# Altium schematic sheet DT_AZP1524B1_SCH1[SHEET2]_00A.SchDoc
size A3; CheckedBy: XXX; Author: DO NOT USE THIS PARAMETER; CompanyName: Azoteq (Pty) Ltd; Engineer: DO NOT USE THIS PARAMETER; SheetNumber: 2; SheetTotal: 2; Sheet_Title: Sheet 2
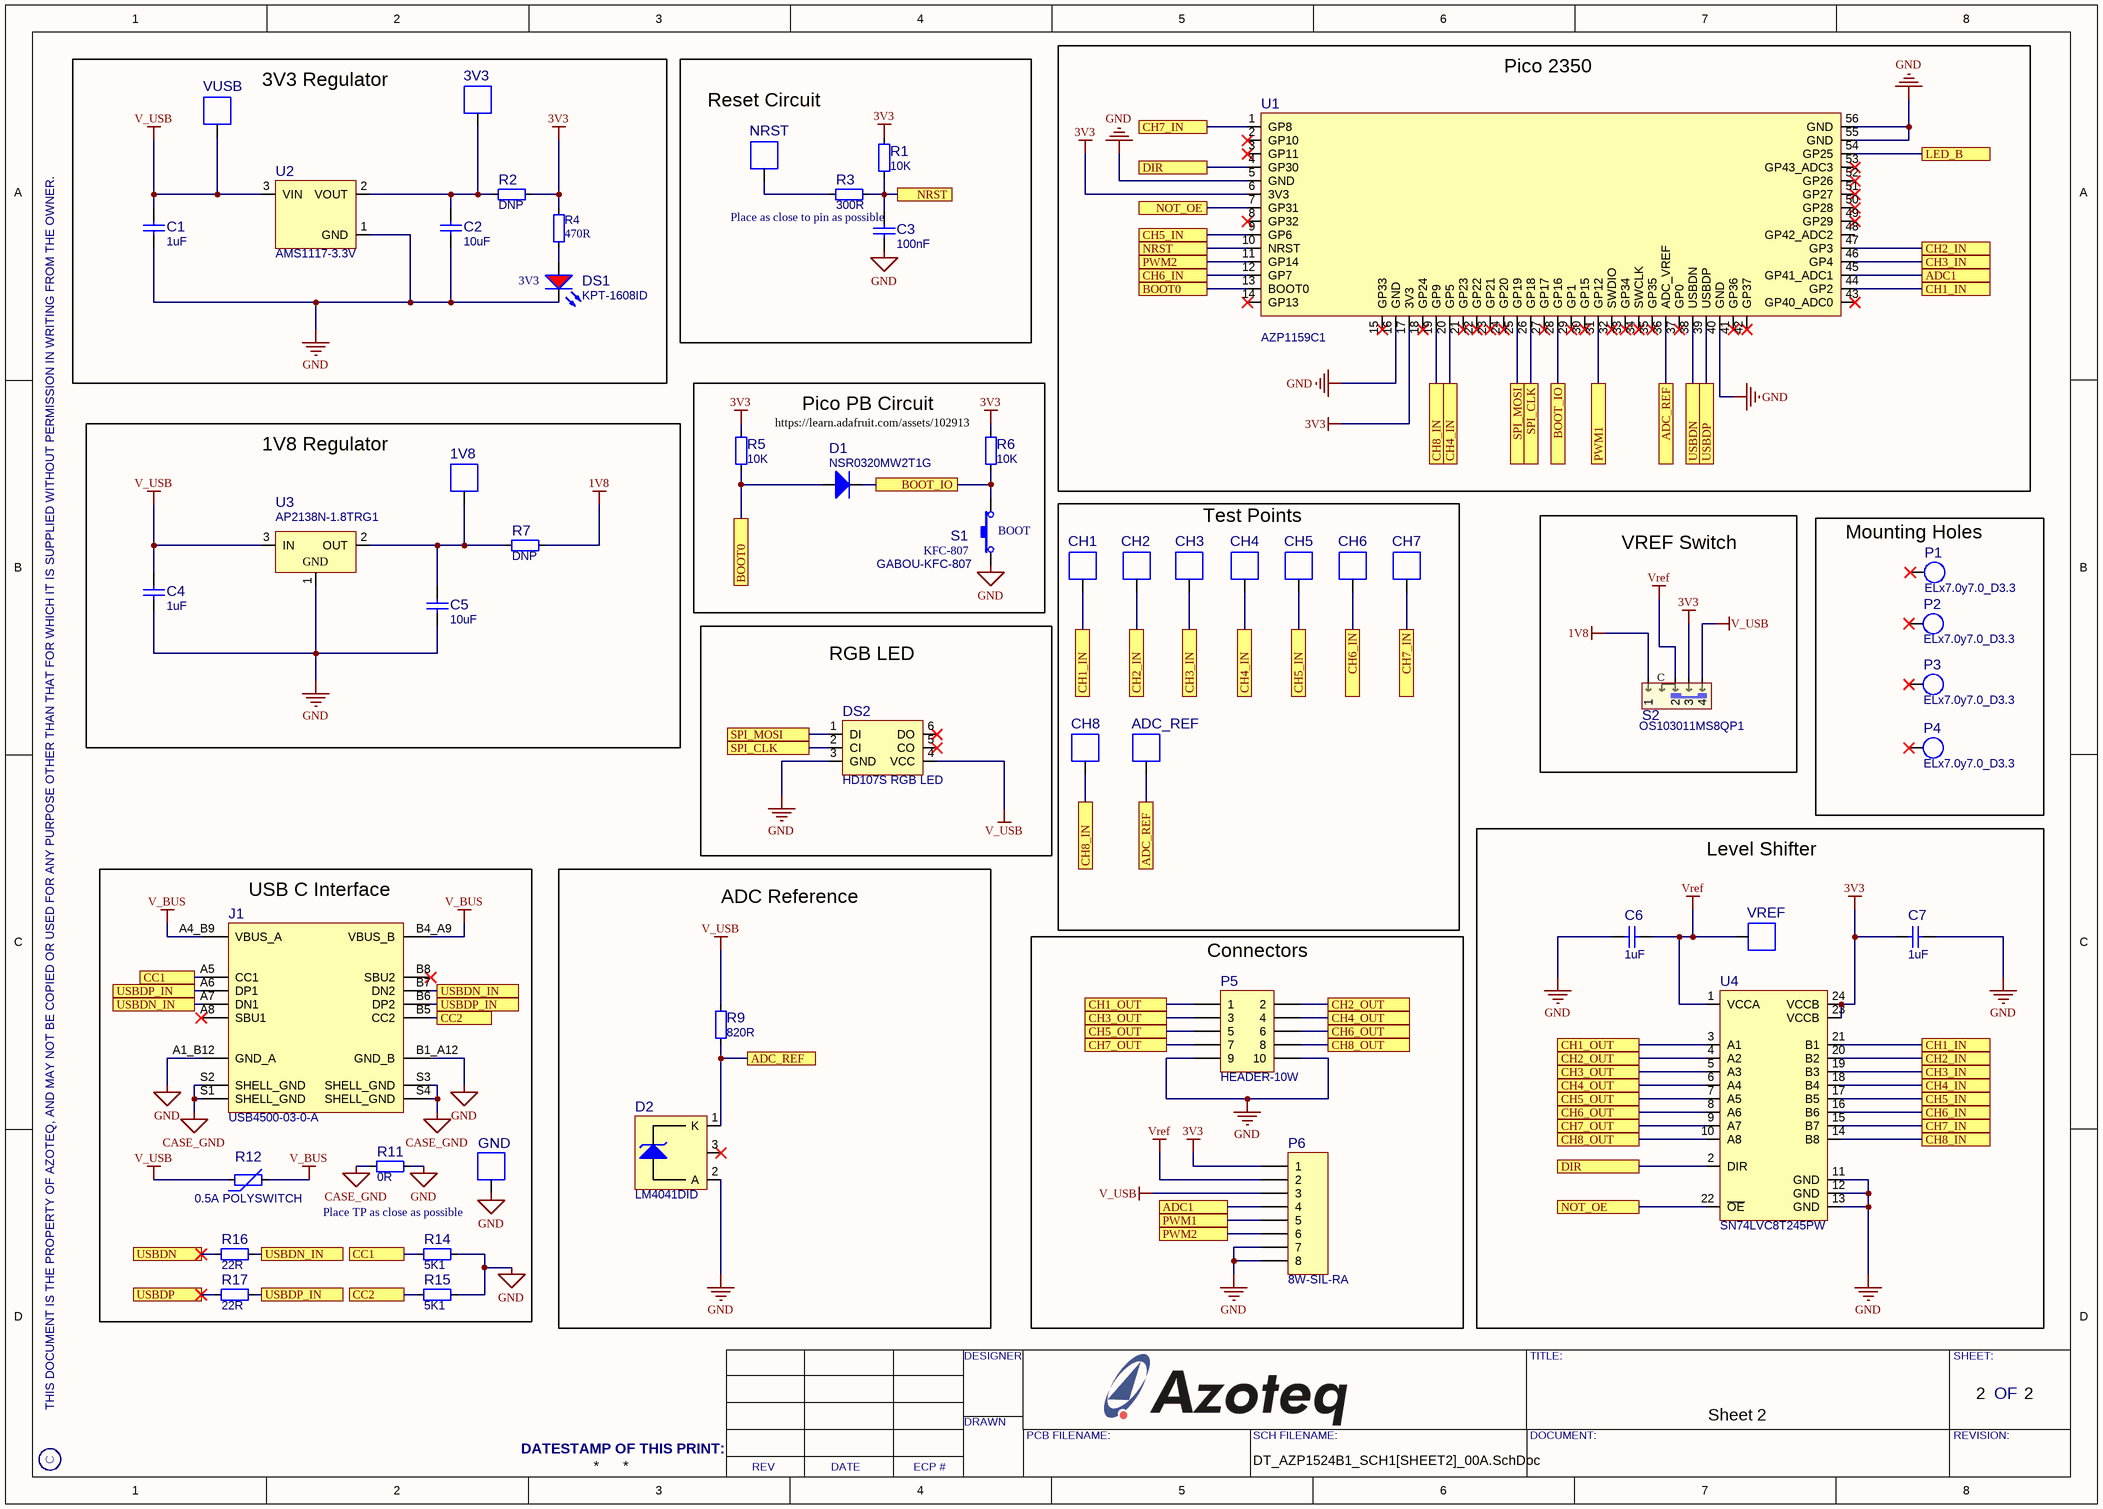
[diagram p0: DT_AZP1524B1_SCH1[SHEET2]_00A.SchDoc]

## Parts
1V8  (no value)  [TEST-POINT-1.5MM]  (no BOM)
3V3  (no value)  [TEST-POINT-1.5MM]  (no BOM)
ADC_REF  (no value)  [TEST-POINT-1.5MM]  (no BOM)
C1  1uF  [C-0603]
C2  10uF  [C-0603]
C3  100nF  [C-0603]
C4  1uF  [C-0603]
C5  10uF  [C-0603]
C6  1uF  [C-0603]
C7  1uF  [C-0603]
CH1  (no value)  [TEST-POINT-1.5MM]  (no BOM)
CH2  (no value)  [TEST-POINT-1.5MM]  (no BOM)
CH3  (no value)  [TEST-POINT-1.5MM]  (no BOM)
CH4  (no value)  [TEST-POINT-1.5MM]  (no BOM)
CH5  (no value)  [TEST-POINT-1.5MM]  (no BOM)
CH6  (no value)  [TEST-POINT-1.5MM]  (no BOM)
CH7  (no value)  [TEST-POINT-1.5MM]  (no BOM)
CH8  (no value)  [TEST-POINT-1.5MM]  (no BOM)
D1  NSR0320MW2T1G  [D-SOD-323]
D2  LM4041DID  [SOT-23]
DS1  KPT-1608ID  [D-LED-RED-0603]
DS2  HD107S RGB LED  [CABA-CBT-5050GHRGB-16T]
GND  (no value)  [TEST-POINT-1.5MM]  (no BOM)
J1  USB4500-03-0-A  [J-USB-GCT-USB4500-03-0-A]
NRST  (no value)  [TEST-POINT-1.5MM]  (no BOM)
P1  ELx7.0y7.0_D3.3  [MPAD-X7.0Y7.0_D3.3]  (no BOM)
P2  ELx7.0y7.0_D3.3  [MPAD-X7.0Y7.0_D3.3]  (no BOM)
P3  ELx7.0y7.0_D3.3  [MPAD-X7.0Y7.0_D3.3]  (no BOM)
P4  ELx7.0y7.0_D3.3  [MPAD-X7.0Y7.0_D3.3]  (no BOM)
P5  HEADER-10W  [P-BERG-10W-HDR-EDGE]
P6  8W-SIL-RA  [P-BERG-8W-HDR-RA-SIL]
R1  10K  [R-0603]
R2  DNP  [R-0603]
R3  300R  [R-0603]
R4  470R  [R-0603]
R5  10K  [R-0603]
R6  10K  [R-0603]
R7  DNP  [R-0603]
R9  820R  [R-0603]
R11  0R  [R-0603]
R12  0.5A POLYSWITCH  [R-POLYSWITCH-1206]
R14  5K1  [R-0603]
R15  5K1  [R-0603]
R16  22R  [R-0603]
R17  22R  [R-0603]
S1  GABOU-KFC-807  value KFC-807  [S-GABOU-KFC-807]
S2  OS103011MS8QP1  [S-C&K-OS103011MS8QP1]
U1  AZP1159C1  [AZP1159C1]
U2  AMS1117-3.3V  [SOT-223]
U3  AP2138N-1.8TRG1  [SOT-23]
U4  SN74LVC8T245PW  [U-TSSOP-24]
VREF  (no value)  [TEST-POINT-1.5MM]  (no BOM)
VUSB  (no value)  [TEST-POINT-1.5MM]  (no BOM)

## Blocks framed on the sheet
3V3 Regulator: 3V3 C1 C2 DS1 R2 R4 U2 VUSB
Reset Circuit: C3 NRST R1 R3
Pico 2350: U1
Pico PB Circuit: D1 R5 R6 S1
1V8 Regulator: 1V8 C4 C5 R7 U3
Test Points: ADC_REF CH1-CH8
VREF Switch: S2
Mounting Holes: P1-P4
RGB LED: DS2
USB C Interface: GND J1 R11 R12 R14-R17
ADC Reference: D2 R9
Level Shifter: C6 C7 U4 VREF
Connectors: P5 P6

## Ports
ADC1, ADC_REF, BOOT0, BOOT_IO, CC1, CC2, CH1_IN, CH1_OUT, CH2_IN, CH2_OUT, CH3_IN, CH3_OUT, CH4_IN, CH4_OUT, CH5_IN, CH5_OUT, CH6_IN, CH6_OUT, CH7_IN, CH7_OUT, CH8_IN, CH8_OUT, DIR, LED_B, NOT_OE, NRST, PWM1, PWM2, SPI_CLK, SPI_MOSI, USBDN, USBDN_IN, USBDP, USBDP_IN

## Nets
1V8: R7.2 S2.1
3V3: C7.2 P6.1 R1.2 R2.2 R4.2 R5.1 R6.1 S2.3 U1.6(3V3) U1.17(3V3) U4.23(VCCB) U4.24(VCCB)
CASE_GND: J1.S1(SHELL_GND) J1.S2(SHELL_GND) J1.S3(SHELL_GND) J1.S4(SHELL_GND) R11.1
GND: C1.1 C2.1 C3.1 C4.1 C5.1 C6.2 C7.1 D2.2(A) DS1.1(K) DS2.3(GND) GND.1 J1.A1_B12(GND_A) J1.B1_A12(GND_B) P5.9 P5.10 P6.7 P6.8 R11.2 R14.2 R15.2 S1.1 U1.5(GND) U1.16(GND) U1.40(GND) U1.55(GND) U1.56(GND) U2.1(GND) U3.1(GND) U4.11(GND) U4.12(GND) U4.13(GND)
V_BUS: J1.A4_B9(VBUS_A) J1.B4_A9(VBUS_B) R12.2
V_USB: C1.2 C4.2 DS2.4(VCC) P6.3 R9.2 R12.1 S2.4 U2.3(VIN) U3.3(IN) VUSB.1
Vref: C6.1 P6.2 S2.2 U4.1(VCCA) VREF.1
ADC1: P6.4 U1.45(GP41_ADC1) ; port ADC1
ADC_REF: ADC_REF.1 D2.1(K) R9.1 U1.36(ADC_VREF) ; port ADC_REF
BOOT0: D1.2(K) R5.2 U1.13(BOOT0) ; port BOOT0
BOOT_IO: D1.1(K) R6.2 S1.2 U1.28(GP16) ; port BOOT_IO
CC1: J1.A5(CC1) R14.1 ; port CC1
CC2: J1.B5(CC2) R15.1 ; port CC2
CH1_IN: CH1.1 U1.44(GP2) U4.21(B1) ; port CH1_IN
CH1_OUT: P5.1 U4.3(A1) ; port CH1_OUT
CH2_IN: CH2.1 U1.47(GP3) U4.20(B2) ; port CH2_IN
CH2_OUT: P5.2 U4.4(A2) ; port CH2_OUT
CH3_IN: CH3.1 U1.46(GP4) U4.19(B3) ; port CH3_IN
CH3_OUT: P5.3 U4.5(A3) ; port CH3_OUT
CH4_IN: CH4.1 U1.20(GP5) U4.18(B4) ; port CH4_IN
CH4_OUT: P5.4 U4.6(A4) ; port CH4_OUT
CH5_IN: CH5.1 U1.9(GP6) U4.17(B5) ; port CH5_IN
CH5_OUT: P5.5 U4.7(A5) ; port CH5_OUT
CH6_IN: CH6.1 U1.12(GP7) U4.16(B6) ; port CH6_IN
CH6_OUT: P5.6 U4.8(A6) ; port CH6_OUT
CH7_IN: CH7.1 U1.1(GP8) U4.15(B7) ; port CH7_IN
CH7_OUT: P5.7 U4.9(A7) ; port CH7_OUT
CH8_IN: CH8.1 U1.19(GP9) U4.14(B8) ; port CH8_IN
CH8_OUT: P5.8 U4.10(A8) ; port CH8_OUT
DIR: U1.4(GP30) U4.2(DIR) ; port DIR
LED_B: U1.54(GP25) ; port LED_B
NOT_OE: U1.7(GP31) U4.22(~{OE}) ; port NOT_OE
NRST: C3.2 R1.1 R3.2 U1.10(NRST) ; port NRST
PWM1: P6.5 U1.31(GP12) ; port PWM1
PWM2: P6.6 U1.11(GP14) ; port PWM2
SPI_CLK: DS2.2(CI) U1.26(GP18) ; port SPI_CLK
SPI_MOSI: DS2.1(DI) U1.25(GP19) ; port SPI_MOSI
USBDN: R16.1 U1.38(USBDN) ; port USBDN
USBDN_IN: J1.A7(DN1) J1.B7(DN2) R16.2 ; port USBDN_IN
USBDP: R17.2 U1.39(USBDP) ; port USBDP
USBDP_IN: J1.A6(DP1) J1.B6(DP2) R17.1 ; port USBDP_IN
Net1V8_1: 1V8.1 C5.2 R7.1 U3.2(OUT)
Net3V3_1: 3V3.1 C2.2 R2.1 U2.2(VOUT)
NetDS1_2: DS1.2(A) R4.1
NetNRST_1: NRST.1 R3.1

Not connected (* = marked no-connect by the designer): D2 3*; DS2 5(CO)* 6(DO)*; J1 A8(SBU1)* B8(SBU2)*; P1 1*; P2 1*; P3 1*; P4 1*; U1 2(GP10)* 3(GP11)* 8(GP32)* 14(GP13)* 15(GP33)* 18(GP24)* 21(GP23)* 22(GP22)* 23(GP21)* 24(GP20)* 27(GP17)* 29(GP1)* 30(GP15)* 32(SWDIO)* 33(GP34)* 34(SWCLK)* 35(GP35)* 37(GP0)* 41(GP36)* 42(GP37)* 43(GP40_ADC0)* 48(GP42_ADC2) 49(GP29)* 50(GP28)* 51(GP27)* 52(GP26)* 53(GP43_ADC3)*

## Notes on the sheet
- (near C3) Place as close to pin as possible
- (near DS1) 3V3
- (near R6) https://learn.adafruit.com/assets/102913
- (near S1) BOOT
- Place TP as close as possible
- DESIGNER
- TITLE:
- SHEET:
- OF
- THIS DOCUMENT IS THE PROPERTY OF AZOTEQ, AND MAY NOT BE COPIED OR USED FOR ANY PURPOSE OTHER THAN THAT FOR WHICH IT IS SUPPLIED WITHOUT PERMISSION IN WRITING FROM THE OWNER.
- C
- DATESTAMP OF THIS PRINT:
- REV
- DATE
- ECP #
- DRAWN
- PCB FILENAME:
- SCH FILENAME:
- DOCUMENT:
- REVISION:
- (in symbol C&K-OS103011MS8QP1) C

## Library data of the parts
1V8 3V3 ADC_REF CH1-CH8 GND NRST VREF VUSB = TEST-POINT-SMD-1.5MM: Generated_By: GHM; Int_Part_Number: *; Checked_By: *; Checked_Date: *; HelpURL: *; ComponentLink1Description: Footprint Detail; ComponentLink1URL: *; ComponentLink2Description: Application Note; ComponentLink2URL: *; ComponentLink3Description: Layout Guidelines; ComponentLink3URL: *; Wattage: *; Int_Note: *
C1 C4 C6 C7 = CAP 1u0F 0603 CER X5R 10% 10V: Capacitor, Ceramic, 1uF, 0603, X5R, 10%, 10V; Int_Part_Number: CAP0021; Manufacturer: Samsung; Manufacturer_PN: CL10A105KP8NNNC; Checked_By: Jason Reinecke; 3D Model: YES; Int_Note: Created for Marike Swart; Generated_By: JR; Pin_Count: 2; Type: SMT; Dept.: LightSense; Generated_Date: 2023-04-06; HelpURL: \\azoteq-files1\PCBCAD\Datasheets\Capacitors\Samsung\CL10A105KP8NNNC_Spec.pdf; ComponentLink1Description: Footprint Detail; ComponentLink1URL: *; ComponentLink2Description: Application Note; ComponentLink2URL: *; ComponentLink3Description: Layout Guidelines; ComponentLink3URL: *; Tolerance: 10%; Wattage: *; Voltage: 10V; Value: 1uF; Local_Supplier: Mouser; Local_Supplier_PN: 187-CL10A105KP8NNNC; Offshore_Supplier: Digikey; Offshore_Supplier_PN: 1276-1182-2-ND; Supplier: Azoteq
C2 C5 = CAP 10uF 0603 CER X5R 20% 6V3 SAMSUNG: Capacitor, Ceramic, 10uF, 0603, X5R, 20%, 6V3 SAMSUNG; Int_Part_Number: CAP0076; Manufacturer_PN: CL10A106MQ8NNNC; Checked_By: Jason Reinecke; 3D Model: YES; Int_Note: Created for Marike Swart; Generated_By: JR; Pin_Count: 2; Type: SMT; Dept.: LightSense; Manufacturer: SAMSUNG; Generated_Date: 2023-04-05; HelpURL: \\Azoteq-files1\pcbcad\Datasheets\Capacitors\TDK Ceramic Mid Voltage.pdf; ComponentLink1Description: Footprint Detail; ComponentLink1URL: *; ComponentLink2Description: Application Note; ComponentLink2URL: *; ComponentLink3Description: Layout Guidelines; ComponentLink3URL: *; Tolerance: 20%; Wattage: *; Voltage: 6V3; Value: 10uF; Local_Supplier: Mouser; Local_Supplier_PN: 187-CL10A106MQ8NNNC; Offshore_Supplier: Digikey; Offshore_Supplier_PN: 1276-1119-2-ND; Supplier: Azoteq
C3 = CAP 100nF 0603 CER X7R 10% 50V: Capacitor, Ceramic, 100nF, 0603, X7R, 10%, 50V; Int_Part_Number: CAP0032; Manufacturer: Samsung; Manufacturer_PN: CL10B104KB8NNNC; Checked_By: Jason Reinecke; Int_Note: Created for Marike Swart; Generated_By: JR; Pin_Count: 2; Type: SMT; 3D Model: YES; Dept.: LightSense; Generated_Date: 2023-04-20; HelpURL: \\Azoteq-files1\pcbcad\Datasheets\Capacitors\Samsung Ceramic.pdf; ComponentLink1Description: Footprint Detail; ComponentLink1URL: *; ComponentLink2Description: Application Note; ComponentLink2URL: *; ComponentLink3Description: Layout Guidelines; ComponentLink3URL: *; Tolerance: 10%; Wattage: *; Voltage: 50V; Value: 100nF; Local_Supplier: Mouser; Local_Supplier_PN: 187-CL10B104KB8NNNC; Offshore_Supplier: Digikey; Offshore_Supplier_PN: 1276-1000-2-ND; Supplier: Azoteq
D1 = Diode Schottky 20V 1A SOD-323: Diode Schottky 20V 1A 2-Pin SOD-323 T/R; Int_Part_Number: DIO0074; Manufacturer: ONsemiconductors; Generated_By: JR; Pin_Count: 2; Type: SMT; Manufacturer_PN: NSR0320MW2T1G; Checked_By: *; Checked_Date: *; Generated_Date: 2017-09-11; ComponentLink1Description: Footprint Detail; ComponentLink1URL: *; ComponentLink2Description: Application Note; ComponentLink2URL: *; ComponentLink3Description: Layout Guidelines; ComponentLink3URL: *; Wattage: 1A; Voltage: 20V; Int_Note: *; Value: NSR0320MW2T1G; Supplier: Azoteq; MSL: 1
D2 = DIODE-ZENER-LM4041-SOT-23: Manufacturer: Texas Instruments; Manufacturer_PN: LM4041DIDBZTG4; Generated_By: GHM; Pin_Count: 3; Type: SMT; Checked_By: *; Checked_Date: *; Generated_Date: 2012-03-13; HelpURL: \\Azoteq-files1\pcbcad\Datasheets\Voltage References\Texas Instruments\LM4041DIDBZTG4.pdf; ComponentLink1Description: Footprint Detail; ComponentLink1URL: *; ComponentLink2Description: Application Note; ComponentLink2URL: *; ComponentLink3Description: Layout Guidelines; ComponentLink3URL: *; Wattage: *; Int_Note: *; Value: LM4041DID; Local_Supplier: RS Components; Local_Supplier_PN: 661-9405; Supplier: Azoteq
DS1 = LED-KPT1608ID-RED-0603: Manufacturer: KingBright; Generated_By: GHM; Pin_Count: 2; Type: SMT; Int_Part_Number: *; Manufacturer_PN: KPT-1608ID; Checked_By: *; Checked_Date: *; HelpURL: \\Azoteq-files1\pcbcad\Datasheets\LEDs\KingBright\KPT-1608.pdf; ComponentLink1Description: Footprint Detail; ComponentLink1URL: *; ComponentLink2Description: Application Note; ComponentLink2URL: *; ComponentLink3Description: Layout Guidelines; ComponentLink3URL: *; Wattage: *; Int_Note: *; Value: KPT-1608ID; Local_Supplier: Communica; Local_Supplier_PN: KPT-1608ID; Supplier: Azoteq
DS2 = LED-NEWSTAR-HD107S RGB LED: LED, 5.5x5.0x1.6mm TOP SMD Type 0.2Watt; Manufacturer: NEW STAR LED CO., LIMITED; 3D_Part: No; Voltage: 5V; Int_Note: Created for Nico Lochner; Generated_By: JR; Pin_Count: 6; Type: SMT; Manufacturer_PN: HD107S; Checked_By: *; Checked_Date: *; Generated_Date: 2020-10-23; HelpURL: \\azoteq-files1\PCBCAD\Datasheets\LEDs\NewStar\HD107S-NEWSTAR.pdf; ComponentLink1Description: Footprint Detail; ComponentLink1URL: *; ComponentLink2Description: Application Note; ComponentLink2URL: *; ComponentLink3Description: Layout Guidelines; ComponentLink3URL: *; Wattage: *; Value: HD107S RGB LED; Supplier: Azoteq
J1 = USB-GCT-USB4500-03-0-A: USB-C TYPE REC 16P, 3U" MID MNT 0.8MM USB2.0; Int_Part_Number: NONE; Manufacturer: GCT; Checked_By: Jason Reinecke; Tolerance: na; Wattage: 5A; Voltage: 20V; Int_Note: Created for Ferdinand Stegmann; Generated_By: JR; Pin_Count: 16; Dept.: ProxSense; 3D Model: YES; Manufacturer_PN: USB4500-03-0-A; Generated_Date: 2022-02-24; HelpURL: \\azoteq-files1\PCBCAD\Datasheets\USB\GCT\usb4500.pdf; ComponentLink1Description: Footprint Detail; ComponentLink1URL: *; ComponentLink2Description: Application Note; ComponentLink2URL: *; ComponentLink3Description: Layout Guidelines; ComponentLink3URL: *; Value: USB4500-03-0-A; Local_Supplier: Mouser; Local_Supplier_PN: 640-USB4500030A; Offshore_Supplier: Digikey; Offshore_Supplier_PN: 2073-USB4500-03-0-ATR-ND; Type: SMT; Supplier: Azoteq
P1-P4 = MPAD-ELx7.0y7.0_D3.3: Generated_By: GHM; Int_Part_Number: *; Checked_By: *; Checked_Date: *; Generated_Date: 2013-08-27; HelpURL: *; ComponentLink1Description: Footprint Detail; ComponentLink1URL: *; ComponentLink2Description: Application Note; ComponentLink2URL: *; ComponentLink3Description: Layout Guidelines; ComponentLink3URL: *; Wattage: *; Int_Note: *; Value: ELx7.0y7.0_D3.3
P5 = BERG-10W-HDR-EDGE: Connector, Header, Edge Mount,DIL, 10W, SMT; Generated_By: GHM; Pin_Count: 10; Int_Part_Number: *; Checked_By: *; Checked_Date: *; Generated_Date: 2013-07-29; ComponentLink1Description: Footprint Detail; ComponentLink1URL: *; ComponentLink2Description: Application Note; ComponentLink2URL: *; ComponentLink3Description: Layout Guidelines; ComponentLink3URL: *; Wattage: *; Int_Note: *; Value: HEADER-10W; Local_Supplier: Communica; Type: SMT; Supplier: Azoteq
P6 = BERG-8W-HDR-RA-SIL: Connector, Header, Right angle, SIL, 8W, THP; Manufacturer: Ho Chien; Generated_By: GHM; Pin_Count: 8; ComponentLink1Description: Footprint Detail; ComponentLink2Description: Application Note; ComponentLink3Description: Layout Guidelines; HelpURL: \\azoteq-files1\pcbcad\Datasheets\Headers\Ho Chien Pin Header 2.54mm.pdf; Local_Supplier: Communica; Local_Supplier_PN: 709401; Value: 8W-SIL-RA; Type: THP; Supplier: Azoteq
R1 R3 R5 R6 = MNFR 0603 5% 0.1W: Resistor, 0603, 5%, 0.1W; Int_Part_Number: MNFR04; Checked_By: Jason Reinecke; Generated_By: JR; Pin_Count: 2; 3D Model: YES; Generated_Date: 2017-02-01; HelpURL: *; ComponentLink1Description: Footprint Detail; ComponentLink1URL: *; ComponentLink2Description: Application Note; ComponentLink2URL: *; ComponentLink3Description: Layout Guidelines; ComponentLink3URL: *; Tolerance: 5%; Wattage: 0.1W; Int_Note: *; Local_Supplier: Mouser; Offshore_Supplier: Digikey; Type: SMT; Supplier: Assembly Manufacturer
R2 R7 = RES DNP 0603: Resistor, DNP, 0603; Checked_By: Jason Reinecke; Generated_By: JR; Pin_Count: 2; 3D Model: YES; Int_Part_Number: DNP; Generated_Date: 2010-01-05; HelpURL: *; ComponentLink1Description: Footprint Detail; ComponentLink1URL: *; ComponentLink2Description: Application Note; ComponentLink2URL: *; ComponentLink3Description: Layout Guidelines; ComponentLink3URL: *; Int_Note: *; Local_Supplier: Mouser; Offshore_Supplier: Digikey; Value: DNP; Type: SMT; Supplier: Azoteq
R4 = RES 470R 0603 5% 0.1W Yageo: Res Thick Film 0603 470 Ohm 5% 0.1W(1/10W) ±100ppm/°C Molded SMD Paper T/R; Int_Part_Number: RES0307; Manufacturer: Yageo; Manufacturer_PN: RC0603JR-07470RL; Checked_By: Jason Reinecke; Generated_By: JR; Pin_Count: 2; 3D Model: YES; ComponentLink1Description: Footprint Detail; ComponentLink1URL: *; ComponentLink2Description: Application Note; ComponentLink2URL: *; ComponentLink3Description: Layout Guidelines; ComponentLink3URL: *; Generated_Date: 2017-07-01; HelpURL: *; Int_Note: *; Local_Supplier: Mouser; Offshore_Supplier: Digikey; Tolerance: 5%; Value: 470R; Wattage: 0.1W; Type: SMT; SheetPart: *; Supplier: Azoteq
R9 = RES 820R 0603 1% 0.1W: Resistor, 820R, 0603, 1%, 0.1W; Checked_By: Jason Reinecke; Generated_By: JR; Pin_Count: 2; 3D Model: YES; Int_Part_Number: *; Generated_Date: 2009-10-13; HelpURL: *; ComponentLink1Description: Footprint Detail; ComponentLink1URL: *; ComponentLink2Description: Application Note; ComponentLink2URL: *; ComponentLink3Description: Layout Guidelines; ComponentLink3URL: *; Tolerance: 1%; Wattage: 0.1W; Int_Note: *; Value: 820R; Local_Supplier: Mouser; Local_Supplier_PN: CHR0603 1% 820R; Offshore_Supplier: Digikey; Type: SMT; Supplier: Azoteq
R11 = RES 0R 0603 1% 0.1W Yageo: Res Thick Film 0603 0 Ohm Molded SMD Paper T/R; Int_Part_Number: RES0139; Manufacturer: Yageo; Manufacturer_PN: RC0603JR--070R; Checked_By: Jason Reinecke; Tolerance: 1%; Wattage: 0.1W; Generated_By: JR; Pin_Count: 2; 3D Model: YES; Generated_Date: 2009-10-13; HelpURL: *; ComponentLink1Description: Footprint Detail; ComponentLink1URL: *; ComponentLink2Description: Application Note; ComponentLink2URL: *; ComponentLink3Description: Layout Guidelines; ComponentLink3URL: *; Int_Note: *; Value: 0R; Local_Supplier: Mouser; Offshore_Supplier: Digikey; Type: SMT; Supplier: Azoteq
R12 = POLYSWITCH-nanoSMDC050F/13.2: Polyswitch, nanoSMDC050F, 1206, 0.5A, 13.2V; Int_Part_Number: SWT0070; Manufacturer: Tyco; Checked_By: Jason Reinecke; Generated_By: JR; Pin_Count: 2; Manufacturer_PN: nanoSMDC050F/13.2; Generated_Date: 2011-02-25; HelpURL: \\Azoteq-files1\pcbcad\Datasheets\PTC\Tyco Electronics\Raychem PolySwitch 2011.pdf; ComponentLink1Description: Footprint Detail; ComponentLink1URL: *; ComponentLink2Description: Application Note; ComponentLink2URL: *; ComponentLink3Description: Layout Guidelines; ComponentLink3URL: *; Wattage: *; Int_Note: *; Value: 0.5A POLYSWITCH; Local_Supplier: Mouser; Local_Supplier_PN: 138-679; Offshore_Supplier: Digikey; Type: SMT; Supplier: Azoteq
R14-R17 = MNFR 0603 1% 0.1W: Resistor, 0603, 1%, 0.1W; Int_Part_Number: MNFR03; Generated_By: JR; Pin_Count: 2; Checked_By: *; Checked_Date: *; Generated_Date: 2017-02-01; HelpURL: *; ComponentLink1Description: Footprint Detail; ComponentLink1URL: *; ComponentLink2Description: Application Note; ComponentLink2URL: *; ComponentLink3Description: Layout Guidelines; ComponentLink3URL: *; Tolerance: 1%; Wattage: 0.1W; Int_Note: *; Type: SMT; Supplier: Assembly Manufacturer
  R14 R15: Value: 5K1
  R16 R17: Value: 22R
S1 = GABOU-KFC-807: SWITCH TACTILE SPST-NO 0.05A 12V; Manufacturer: GABOU; Int_Note: Created for Dylan Els; Generated_By: JR; Pin_Count: 2; Manufacturer_PN: KFC-807; Generated_Date: 201-06-18; HelpURL: http://www.gaboukeji.com/plus/view.php?aid=2679&vv=cn; ComponentLink1Description: Footprint Detail; ComponentLink2Description: Application Note; ComponentLink3Description: Layout Guidelines; Voltage: 12V; Type: SMT; Supplier: Azoteq
S2 = C&K-OS103011MS8QP1: SWITCH SLIDE SP3T 100MA 12V; Manufacturer: C&K; 3D_Part: No; Generated_By: JR; Pin_Count: 4; ComponentLink1Description: Footprint Detail; ComponentLink2Description: Application Note; ComponentLink3Description: Layout Guidelines; Generated_Date: 2018-04-24; HelpURL: \\Azoteq-files1\pcbcad\Datasheets\Switches\C&K\OS103011MS8QP1.pdf; Local_Supplier: Digikey; Local_Supplier_PN: CKN9543-ND; Manufacturer_PN: OS103011MS8QP1; Value: OS103011MS8QP1; Type: SMT; Supplier: Azoteq
U1 = AZP1159C1: AZP115C01: RP2350 Stamp (Pi Pico) - stamp breakout; Int_Part_Number: NONE; Manufacturer: Azoteq; Checked_By: Jason Reinecke; 3D Model: YES; Tolerance: na; Int_Note: Created for; Generated_By: JR; Pin_Count: 56; Dept.: ProxSense; Manufacturer_PN: AZP1159C1; Generated_Date: 2025-08-07; HelpURL: *; ComponentLink1Description: Footprint Detail; ComponentLink1URL: *; ComponentLink2Description: Application Note; ComponentLink2URL: *; ComponentLink3Description: Layout Guidelines; ComponentLink3URL: *; Wattage: *; Voltage: *; Value: AZP1159C1; Local_Supplier: Azoteq; Local_Supplier_PN: AZP1159C1; Offshore_Supplier: Azoteq; Offshore_Supplier_PN: AZP1159C1; Type: SMT; Supplier: Azoteq
U2 = AMS1117-MSKSEMI-SOT-223: IC, Voltage Regulator, 3.3V Out, 4.7-18V In, 1A; Int_Part_Number: NONE; Checked_By: Jason Reinecke; 3D Model: YES; Int_Note: Created for Kyle Steyn; Generated_By: JR; Pin_Count: 4; Manufacturer: MSKSEMI; Manufacturer_PN: AMS1117-3.3V; Generated_Date: 2024-06-03; HelpURL: \\azoteq-files1\PCBCAD\Datasheets\Voltage Regulators\MSKSEMI\MSKSEMI-AMS1117-3-3V.pdf; ComponentLink1Description: Footprint Detail; ComponentLink1URL: *; ComponentLink2Description: Application Note; ComponentLink2URL: *; ComponentLink3Description: Layout Guidelines; ComponentLink3URL: *; Tolerance: *; Wattage: *; Voltage: 3.3V; Value: AMS1117-3.3V; Local_Supplier: Mouser; Local_Supplier_PN: 863-LM1117MPX-33NOPB; Offshore_Supplier: Digikey; Offshore_Supplier_PN: 4518-AMS1117-3.3TR-ND; Type: SMT; Supplier: Azoteq
U3 = AP2138N-1.8TRG1-SOT-23: IC REG LINEAR 1.8V 250MA SOT23-3; Manufacturer: Diodes Incorporated; Checked_By: Jason Reinecke; 3D Model: YES; Int_Note: Created for Robert Samuel; Generated_By: JR; Pin_Count: 3; Int_Part_Number: *; Manufacturer_PN: AP2138N-1.8TRG1; Generated_Date: 2026-01-16; HelpURL: \\azoteq-files1\PCBCAD\Datasheets\Voltage Regulators\Diodes Inc\AP2138-9.pdf; ComponentLink1Description: Footprint Detail; ComponentLink1URL: *; ComponentLink2Description: Application Note; ComponentLink2URL: *; ComponentLink3Description: Layout Guidelines; ComponentLink3URL: *; Tolerance: *; Wattage: *; Voltage: 1.8V; Value: AP2138N-1.8TRG1; Local_Supplier: Mouser; Local_Supplier_PN: 621-AP2138N-1.8TRG1; Offshore_Supplier: Digikey; Offshore_Supplier_PN: AP2138N-1.8TRG1DITR-ND; Type: SMT; Supplier: Azoteq
U4 = SN74LVC8T245PW-TSSOP-24: Manufacturer: Texas Instruments; Manufacturer_PN: SN74LVC8T245PWG4; Generated_By: GHM; Pin_Count: 24; Int_Part_Number: *; Checked_By: *; Checked_Date: *; Generated_Date: 2012-03-13; HelpURL: \\Azoteq-files1\pcbcad\Datasheets\Tranceivers\Texas Instruments\SN74LVC8T245PWG4.pdf; ComponentLink1Description: Footprint Detail; ComponentLink1URL: *; ComponentLink2Description: Application Note; ComponentLink2URL: *; ComponentLink3Description: Layout Guidelines; ComponentLink3URL: *; Wattage: *; Int_Note: *; Value: SN74LVC8T245PW; Local_Supplier: RS Components; Local_Supplier_PN: 663-2919; Type: SMT; Supplier: Azoteq